# Altium schematic sheet Audio.SchDoc
size A4; SheetNumber: 4; SheetTotal: 10
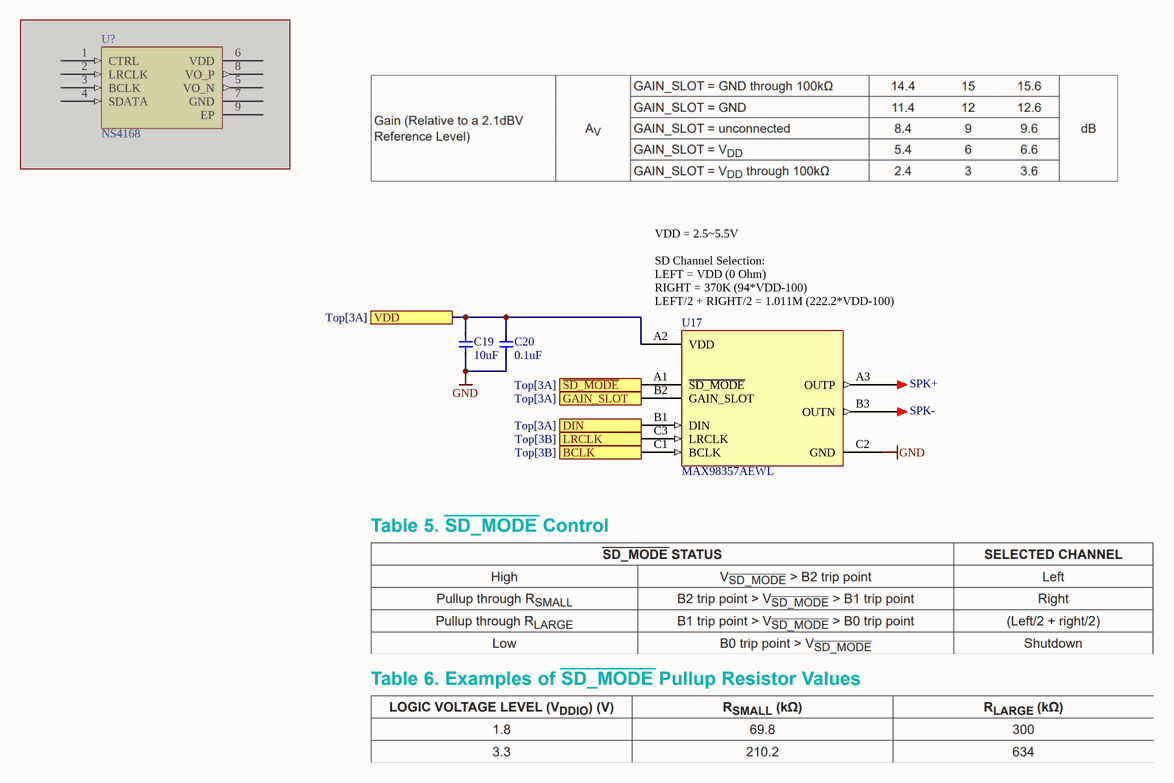
[diagram p0: Audio.SchDoc]

## Parts
C19  10uF  [0402-C]
C20  0.1uF  [0402-C]
SPK+  (no value)  [SMD_L2.2-W1.0_KH-221020-TP]
SPK-  (no value)  [SMD_L2.2-W1.0_KH-221020-TP]
U17  MAX98357AEWL  [WLP-9_L1.4-W1.3-P0.40-R3-C3-BR]
U?  NS4168  [ESOP8_L]  (masked out: inside a compile mask, not in the netlist)

## Ports
BCLK (in, see Top[3B]), DIN (in, see Top[3A]), GAIN_SLOT (see Top[3A]), LRCLK (in, see Top[3B]), VDD (see Top[3A]), ~{SD_MODE} (see Top[3A])

## Nets
GND: C19.1 C20.1 U17.C2(GND)
BCLK: U17.C1(BCLK) ; port BCLK
DIN: U17.B1(DIN) ; port DIN
GAIN_SLOT: U17.B2(GAIN_SLOT) ; port GAIN_SLOT
LRCLK: U17.C3(LRCLK) ; port LRCLK
~{SD_MODE}: U17.A1(~{SD_MODE}) ; port ~{SD_MODE}
VDD: C19.2 C20.2 U17.A2(VDD) ; port VDD
NetSPK+_1: SPK+.1 U17.A3(OUTP)
NetSPK-_1: SPK-.1 U17.B3(OUTN)

## Notes on the sheet
- (near U17) VDD = 2.5~5.5V
  SD Channel Selection:
  LEFT = VDD (0 Ohm)
  RIGHT = 370K (94*VDD-100)
  LEFT/2 + RIGHT/2 = 1.011M (222.2*VDD-100)

## Library data of the parts
C19 C20 = 电容-0402: Capacitor; Value: 0.1u
SPK+ SPK- = TEST: 测试点; 联系下单店铺卖家 免费技术支持: 联系下单店铺卖家 免费帮你查找封装; BOM名称: 测试点